# Altium schematic sheet DC_Regulator.SchDoc
size B; SheetNumber: 2; SheetTotal: 5
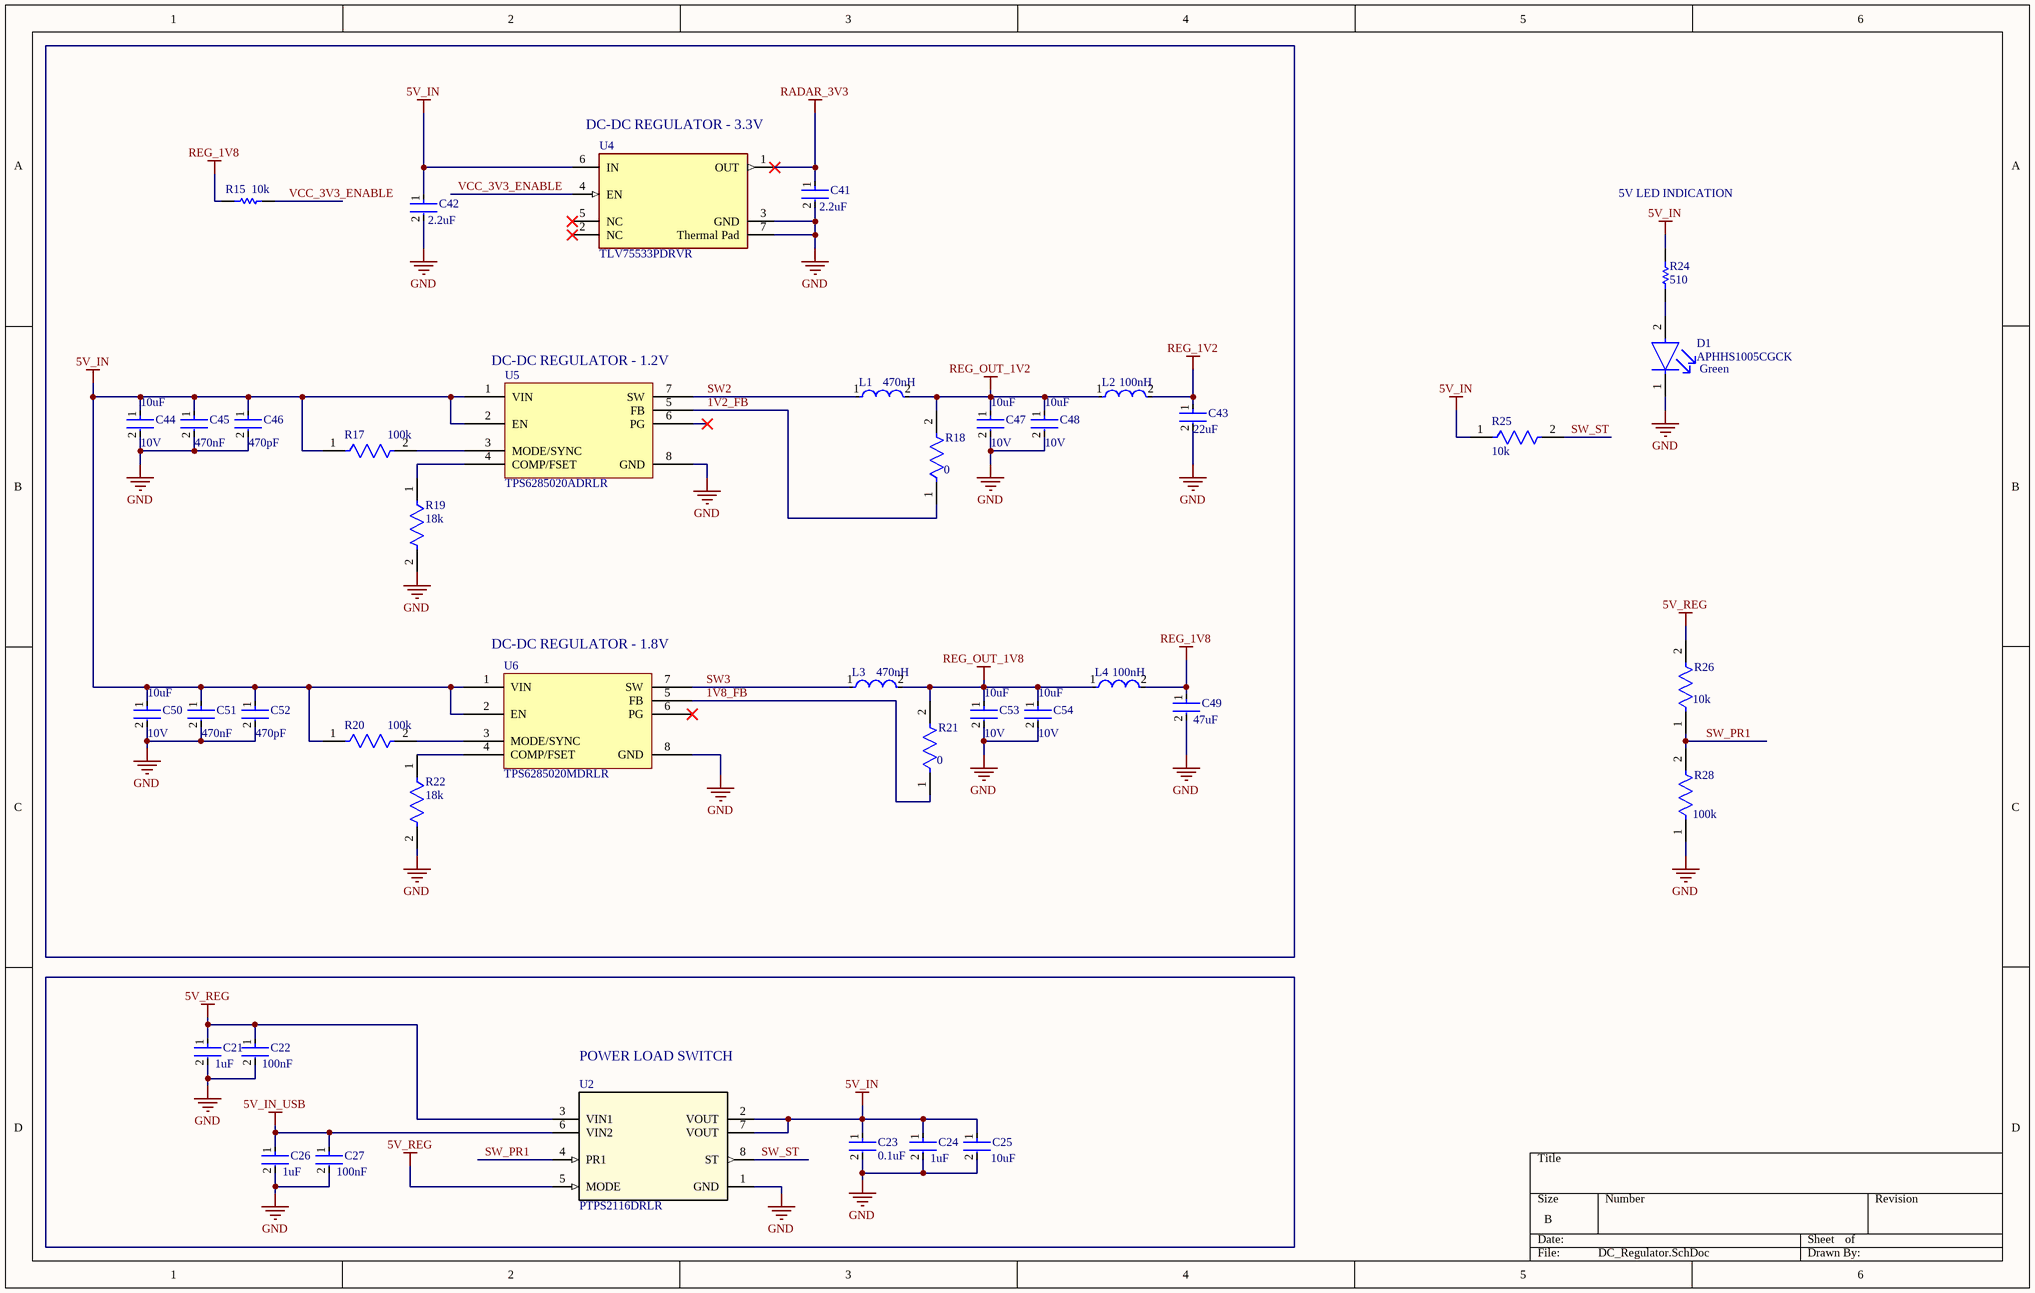
[diagram p0: DC_Regulator.SchDoc]

## Parts
C21  Capacitance: 1uF  [FP-GRT155-0_05-IPC_B]  (hidden comment: GRT155C81A105KE01D)
C22  Capacitance: 100nF  [FP-GCM155-0_05-IPC_A]  (hidden comment: GCM155R71H104KE02D)
C23  0.1uF  [FP-C0402-BB-MFG]
C24  Capacitance: 1uF  [FP-GRT155-0_05-IPC_B]  (hidden comment: GRT155C81A105KE01D)
C25  value 10uF  [FP-GRM188-0_2-IPC_B]  (hidden comment: GRM188Z71A106MA73D)
C26  Capacitance: 1uF  [FP-GRT155-0_05-IPC_B]  (hidden comment: GRT155C81A105KE01D)
C27  Capacitance: 100nF  [FP-GCM155-0_05-IPC_A]  (hidden comment: GCM155R71H104KE02D)
C41  Capacitance: 2.2uF  [FP-GRM155-0_2-MFG]  (hidden comment: GRM155C81C225KE11D)
C42  Capacitance: 2.2uF  [FP-GRM155-0_2-MFG]  (hidden comment: GRM155C81C225KE11D)
C43  Capacitance: 22uF  [FP-GRM31C-0_2-e0_3_0_8-MFG]  (hidden comment: GRM31CR70J226ME19K)
C44  Voltage Rating (DC): 10V  Capacitance: 10uF  [FP-GRM188-0_2-MFG]  (hidden comment: GRM188C81A106MA73D)
C45  Capacitance: 470nF  [FP-GRM188-0_1-e0_2_0_5-IPC_B]  (hidden comment: GRM188R71C474KA88D)
C46  Capacitance: 470pF  [FP-GRM155-0_05-IPC_A]  (hidden comment: GRM1555C1H471JA01D)
C47  Voltage Rating (DC): 10V  Capacitance: 10uF  [FP-GRM188-0_2-MFG]  (hidden comment: GRM188C81A106MA73D)
C48  Voltage Rating (DC): 10V  Capacitance: 10uF  [FP-GRM188-0_2-MFG]  (hidden comment: GRM188C81A106MA73D)
C49  Capacitance: 47uF  [FP-GRM31C-0_2-e0_3_0_8-IPC_C]  (hidden comment: GRM31CR60J476ME19L)
C50  Voltage Rating (DC): 10V  Capacitance: 10uF  [FP-GRM188-0_2-MFG]  (hidden comment: GRM188C81A106MA73D)
C51  Capacitance: 470nF  [FP-GRM188-0_1-e0_2_0_5-IPC_B]  (hidden comment: GRM188R71C474KA88D)
C52  Capacitance: 470pF  [FP-GRM155-0_05-IPC_A]  (hidden comment: GRM1555C1H471JA01D)
C53  Voltage Rating (DC): 10V  Capacitance: 10uF  [FP-GRM188-0_2-MFG]  (hidden comment: GRM188C81A106MA73D)
C54  Voltage Rating (DC): 10V  Capacitance: 10uF  [FP-GRM188-0_2-MFG]  (hidden comment: GRM188C81A106MA73D)
D1  APHHS1005CGCK  Illumination Color: Green  [FP-APHHS1005CGCK-MFG]
L1  470nH  [FP-DFE201210U-MFG]
L2  100nH  [FP-LQM2MPZ_JH-w2_4-MFG]
L3  470nH  [FP-DFE201210U-MFG]
L4  100nH  [FP-LQM2MPZ_JH-w2_4-MFG]
R15  10k  [RESC1005X40X25LL05T10]
R17  Resistance: 100k  [FP-CRCW0402-C-e3-MFG]  (hidden comment: CRCW0402100KFKEDC)
R18  Resistance: 0  [FP-RC0402-0_4-MFG]  (hidden comment: RC0402JR-070RP)
R19  Resistance: 18k  [FP-CRCW0402-e3-MFG]  (hidden comment: CRCW040218K0FKEDC)
R20  Resistance: 100k  [FP-CRCW0402-C-e3-MFG]  (hidden comment: CRCW0402100KFKEDC)
R21  Resistance: 0  [FP-RC0402-0_4-MFG]  (hidden comment: RC0402JR-070RP)
R22  Resistance: 18k  [FP-CRCW0402-e3-MFG]  (hidden comment: CRCW040218K0FKEDC)
R24  value 510  [RESC1005X40X25NL05T05]  (hidden comment: ERJ-2GEJ511X)
R25  Resistance: 10k  [FP-CRCW0402-C-e3-IPC_C]  (hidden comment: CRCW040210K0FKEDC)
R26  Resistance: 10k  [FP-CRCW0402-C-e3-IPC_C]  (hidden comment: CRCW040210K0FKEDC)
R28  Resistance: 100k  [FP-CRCW0402-e3-IPC_C]  (hidden comment: CRCW0402100KFKED)
U2  PTPS2116DRLR  [DRL0008A-MFG]
U4  TLV75533PDRVR  [FP-DRV0006A-IPC_A]
U5  TPS6285020ADRLR  [TPS6285020ADRLR]
U6  TPS6285020MDRLR  [TPS6285020MDRLR]

## Nets
5V_IN: C23.1 C24.1 C25.1 C42.1 C44.1 C45.1 C46.1 C50.1 C51.1 C52.1 R17.1 R20.1 R24.2 R25.1 U2.2(VOUT) U2.7(VOUT) U4.6(IN) U5.1(VIN) U5.2(EN) U6.1(VIN) U6.2(EN)
5V_IN_USB: C26.1 C27.1 U2.6(VIN2)
5V_REG: C21.1 C22.1 R26.2 U2.3(VIN1) U2.5(MODE)
GND: C21.2 C22.2 C23.2 C24.2 C25.2 C26.2 C27.2 C41.2 C42.2 C43.2 C44.2 C45.2 C46.2 C47.2 C48.2 C49.2 C50.2 C51.2 C52.2 C53.2 C54.2 D1.1(C) R19.2 R22.2 R28.1 U2.1(GND) U4.3(GND) U4.7(Thermal_Pad) U5.8(GND) U6.8(GND)
RADAR_3V3: C41.1 U4.1(OUT)
REG_1V2: C43.1 L2.2
REG_1V8: C49.1 L4.2 R15.1
REG_OUT_1V2: C47.1 C48.1 L1.2 L2.1 R18.2
REG_OUT_1V8: C53.1 C54.1 L3.2 L4.1 R21.2
1V2_FB: R18.1 U5.5(FB)
1V8_FB: R21.1 U6.5(FB)
SW2: L1.1 U5.7(SW)
SW3: L3.1 U6.7(SW)
SW_PR1: R26.1 R28.2 U2.4(PR1)
SW_ST: R25.2 U2.8(ST)
VCC_3V3_ENABLE: R15.2 U4.4(EN)
NetD1_2: D1.2(A) R24.1
NetR17_2: R17.2 U5.3(MODE/SYNC)
NetR19_1: R19.1 U5.4(COMP/FSET)
NetR20_2: R20.2 U6.3(MODE/SYNC)
NetR22_1: R22.1 U6.4(COMP/FSET)

Not connected (* = marked no-connect by the designer): U4 2(NC)* 5(NC)*; U5 6(PG)*; U6 6(PG)*

## Notes on the sheet
- (near U4) DC-DC REGULATOR - 3.3V
- 5V LED INDICATION
- (near U5) DC-DC REGULATOR - 1.2V
- (near U6) DC-DC REGULATOR - 1.8V
- POWER LOAD SWITCH

## Library data of the parts
C21 C24 C26 = CMP-06035-006530-1: Multi-Layer Ceramic Capacitor 1uF 10V X6S ±10% 0402 Paper T/R; Thickness: 0.022inch; Tolerance: 10%; Voltage Rating (DC): 10V; Length: 0.039inch; Width: 0.02inch; Max Operating Temperature: 105°C; Ratings: AEC-Q200; Dielectric: X6S; Min Operating Temperature: -55°C; Case/Package: 0402; Voltage Rating: 10V; Packaging: Tape and Reel; Case Code (Metric): 1005; Case Code (Imperial): 0402; Mount: Surface Mount
C22 C27 = CMP-2000-07456-3: Ceramic Capacitor for Automotive 100nF ±10% 50VDC X7R 0402 Paper T/R; Voltage Rating (DC): 50V; Package Quantity: 10000; Tolerance: 10%; Height: 0.5mm; Mount: Surface Mount; Voltage Rating: 50V; Weight: 0.000212oz; Thickness: 0.022inch; Case Code (Imperial): 0402; Length: 0.039inch; Packaging: Tape and Reel; Case Code (Metric): 1005; Min Operating Temperature: -55°C; Termination: SMD/SMT; REACH SVHC: No SVHC; Max Operating Temperature: 125°C; Lead Free: Lead Free; Dielectric: X7R; Ratings: AEC-Q200; Width: 0.5mm; Case/Package: 0402
C23 = CMP-2008-03086-2: CAP CER 0.1UF 10V X7R 0402; Manufacturer Part Number: C0402C104K8RACTU; Manufacturer: Kemet; Capacitance: 0.10 μF; Tolerance: 0.1; Temperature Coefficient: 15%; Value: 0.10 μF; Material: Ceramic; Automotive: No; Temperature Range High: +125°C; Octopart: https://octopart.com/c0402c104k8ractu-kemet-106349; ComponentLink2Description: Datasheet; ComponentLink2URL: https://content.kemet.com/datasheets/KEM_C1002_X7R_SMD.pdf; Temperature: -55°C to +125°C; RoHS: TRUE; Temperature Range Low: -55°C; Temperature Characteristic: X7R; Lead Free: Yes; Height: 0.55mm; Voltage Rating: 10 V; Category: Cap; Device Class L3: Ceramic Capacitors; Digikey Description: CAP CER 0.1UF 10V X7R 0402; Package: C0402-BB; Device Class L1: Passive Components; Ipc Land Pattern Name: CAPC10050X50; Mouser Description: Multilayer Ceramic Capacitors MLCC - SMD/SMT 10volts 0.1uF X7R 10%; Device Class L2: Capacitors
C25 = CMP-06035-036920-1: Chip Multilayer Ceramic Capacitors for General Purpose, 0603, 10uF, X7R, 15%, 20%, 10V; Case/Package: 0603
C41 C42 = CMP-06035-059778-1: Chip Multilayer Ceramic Capacitors for General Purpose, 0402, 2.2uF, X6S, 22%, 10%, 16V; Material: Ceramic; Voltage Rating: 16V; Case/Package: 0402; Tolerance: 10%; Packaging: Tape and Reel; Mount: Surface Mount; Min Operating Temperature: -55°C; Height: 0.3mm; Thickness: 0.022inch; Voltage Rating (DC): 16V; Max Operating Temperature: 105°C; Length: 0.039inch; Width: 0.02inch
C43 = CMP-06035-034814-1: Chip Multilayer Ceramic Capacitors for General Purpose, 1206, 22uF, X7R, 15%, 20%, 6.3V; Packaging: Tape and Reel; Max Operating Temperature: 125°C; Min Operating Temperature: -55°C; Length: 0.126inch; Width: 0.063inch; Voltage Rating: 6.3V; Dielectric: X7R; Package Quantity: 6000; Tolerance: 20%; Weight: 0.001411oz; Mount: Surface Mount; Thickness: 0.071inch; Case/Package: 1206; Voltage Rating (DC): 6.3V
C44 C47 C48 C50 C53 C54 = CMP-06035-002932-1: Chip Multilayer Ceramic Capacitors for General Purpose, 0603, 10uF, X6S, 22%, 20%, 10V; Case Code (Metric): 1608; Max Operating Temperature: 105°C; Thickness: 0.031inch; Width: 0.031inch; Dielectric: X6S; Lead Free: Lead Free; REACH SVHC: No SVHC; Case/Package: 0603; Length: 0.063inch; Min Operating Temperature: -55°C; Package Quantity: 4000; Voltage Rating: 10V; Tolerance: 20%; Packaging: Cut Tape; Material: Ceramic; Mount: Surface Mount; Case Code (Imperial): 0603; Height: 0.8mm
C45 C51 = CMP-2006-02860-2: Chip Multilayer Ceramic Capacitors for General Purpose, 0603, 0.47uF, X7R, 15%, 10%, 16V; Material: Ceramic; Termination: SMD/SMT; Case Code (Imperial): 0603; Height: 0.8mm; Dielectric: X7R; Length: 1.6mm; Packaging: Tape and Reel; Mount: Surface Mount; Thickness: 0.035inch; Voltage Rating (DC): 16V; Case Code (Metric): 1608; REACH SVHC: No SVHC; Depth: 0.8mm; Number of Pins: 2; Max Operating Temperature: 125°C; Min Operating Temperature: -55°C; Width: 0.8mm; Voltage: 16V; Lead Free: Lead Free; Voltage Rating: 16V; Package Quantity: 1; Case/Package: 0603; Tolerance: 10%
C46 C52 = CMP-2008-04369-2: Chip Multilayer Ceramic Capacitors for General Purpose, 0402, 470pF, C0G, 30ppm/°C, 5%, 50V; Insulation Resistance: 10GR; Depth: 0.5mm; Voltage Rating: 50V; Packaging: Tape and Reel; Material: Ceramic; Lead Free: Lead Free; Max Operating Temperature: 125°C; Length: 1mm; Min Operating Temperature: -55°C; Height: 0.5mm; Width: 0.5mm; Thickness: 0.022inch; Voltage: 50V; Termination: SMD/SMT; Dielectric Material: Ceramic; REACH SVHC: No SVHC; Voltage Rating (DC): 50V; Package Quantity: 1; Dielectric: C0G; Radiation Hardening: No; Mount: Surface Mount; Case/Package: 0402; Number of Pins: 2; Tolerance: 5%; Temperature Coefficient: 30ppm/°C; Case Code (Metric): 1005; Case Code (Imperial): 0402
C49 = CMP-2000-06344-2: Chip Multilayer Ceramic Capacitors for General Purpose, 1206, 47uF, X5R, 15%, 20%, 6.3V; Package Quantity: 2000; Mount: Surface Mount; Length: 3.2mm; Thickness: 0.071inch; Lead Free: Lead Free; Tolerance: 20%; Width: 0.063inch; Depth: 1.6mm; Case/Package: 1206; Dielectric: X5R; Radiation Hardening: No; Packaging: Tape and Reel; Voltage Rating (DC): 6.3V; Termination: SMD/SMT; Height: 1.6mm; Max Operating Temperature: 85°C; Case Code (Metric): 3216; Case Code (Imperial): 1206; Voltage: 6.3V; Voltage Rating: 6.3V; Min Operating Temperature: -55°C; Material: Ceramic; REACH SVHC: No SVHC
D1 = CMP-44529-000044-1: LED GREEN CLEAR CHIP SMD; Viewing Angle: 120°; Dominant Wavelength: 570nm; Test Current: 20mA; Luminous Intensity: 50mcd; Forward Voltage: 2.1V; Number of LEDs: 1; Lens Color: Clear; Packaging: Tape and Reel; Max Operating Temperature: 85°C; Length: 1mm; Mount: Surface Mount; Lens Style: Clear; Color: Green; Number of Pins: 2; Wavelength: 570nm; Case/Package: 0402; Width: 0.5mm; Package Quantity: 2000; Case Code (Metric): 1005; Height: 0.6mm; Lead Free: Lead Free; Case Code (Imperial): 0402; Forward Current: 20mA; Min Operating Temperature: -40°C
L1 L3 = CMP-06042-016357-2: FIXED IND .47UH 3.0A 42MOHM
L2 L4 = CMP-06042-016732-1: FIXED IND 0.1UH 4000MA INFOTMT,; RoHS Compliant: Yes
R15 = CMP-2002-07353-1: Part Number: RC0402FR-0710KL; Manufacturer: Yageo / Phycomp
R17 R20 = CMP-02407-010951-1: RES 100K OHM 1% 1/16W 0402; Temperature Coefficient: 100ppm/°C; Power Rating: 62.5mW; Lead Free: Lead Free; Length: 1mm; Tolerance: 1%; Resistor Type: Thick Film; Contact Plating: Tin; Case/Package: SMD/SMT; Min Operating Temperature: -55°C; RoHS Compliant: Yes; Termination: Wraparound; Max Operating Temperature: 155°C; Mount: Surface Mount
R18 R21 = CMP-03412-037830-1: RES SMD 0 OHM JUMPER 1/16W 0402; Max Power Dissipation: 63mW; Width: 0.02inch; Height: 0.016inch; Length: 0.039inch; Number of Terminations: 2; Max Operating Temperature: 155°C; Case Code (Metric): 1005; Resistor Type: Thick Film; RoHS Compliant: Yes; Packaging: Tape and Reel; Min Operating Temperature: -55°C; Case/Package: 0402; Features: Moisture Resistant; Case Code (Imperial): 0402
R19 R22 = CMP-02407-012458-1: RES 18K OHM 1% 1/16W 0402; Power Rating: 63mW; RoHS Compliant: Yes; Case/Package: 0402; Lead Free: Lead Free; Tolerance: 1%
R24 = CMP-2002-00551-1: Manufacturer: Panasonic; Part Number: ERJ-2GEJ511X
R25 R26 = CMP-02407-012085-1: RES 10K OHM 1% 1/16W 0402; Temperature Coefficient: 100ppm/°C; Power Rating: 62.5mW; Lead Free: Lead Free; Max Operating Temperature: 155°C; RoHS Compliant: Yes; Mount: Surface Mount; Min Operating Temperature: -55°C; Termination: Wraparound; Length: 1mm; Resistor Type: Thick Film; Contact Plating: Tin; Tolerance: 1%; Case/Package: Molded
R28 = CMP-2002-08123-3: RES Thick Film, 100kΩ, 1%, 0.063W, 100ppm/°C, 0402; Power Rating: 63mW; Voltage Rating (DC): 50V; Lead Free: Lead Free; Height: 0.35mm; Contact Plating: Tin; Min Operating Temperature: -55°C; Package Quantity: 10000; Case/Package: 0402; Temperature Coefficient: 100ppm/°C; Number of Terminations: 2; Packaging: Tape and Reel; Max Power Dissipation: 63mW; Case Code (Metric): 1005; Mount: Surface Mount; Width: 0.02inch; Termination: SMD/SMT; Length: 1mm; Number of Pins: 2; Weight: 2.3E-05oz; Radiation Hardening: No; Tolerance: 1%; Military Standard: Not; Features: Automotive AEC-Q200; Depth: 0.5mm; Composition: Thick Film; Max Operating Temperature: 155°C; Voltage Rating: 50V; Case Code (Imperial): 0402
U2 = PTPS2116DRLR: 1.6-V to 5.5-V, 40-mâ„¦, 2.5-A, low-IQ, priority power multiplexer ; 8-SOT-5X3 -40 to 125; Manufacturer_Name: Texas Instruments; TYPE: TYPE; RefDes: RefDes; Copyright: Copyright (C) 2025 Ultra Librarian. All rights reserved.; Manufacturer_Part_Number: PTPS2116DRLR
U4 = CMP-04917-000199-1: IC REG LINEAR 3.3V 500MA 6WSON; Number of Regulators: 1; Output Type: Fixed; Max Input Voltage: 5.5V; Dropout Voltage: 238mV; Quiescent Current: 31uA; Output Configuration: Positive; Power Supply Rejection Ratio (PSRR): 52dB; Max Output Voltage: 3.3V; Output Current: 500mA; Min Output Voltage: 3.3V; Packaging: Tape and Reel; Min Operating Temperature: -40°C; Mount: Surface Mount; RoHS Compliant: Yes; Max Operating Temperature: 125°C
U5 = TPS6285020ADRLR: 2.7-V to 6-V, 2-A, adjustable-frequency, step-down converter in SOT583 package 8-SOT-5X3 -40 to 150; Manufacturer: Texas Instruments; Manufacturer Lifecycle Status: ACTIVE; Topology: Buck; Supplier: DigiKey; Supplier Part Number: 296-TPS6285020ADRLRCT-ND; Manufacturer Part Number: TPS6285020ADRLR; RoHS: Compliant; Category: Voltage Regulators - Switching; Stock: 3967; Pricing: 1=1.52, 10=1.11, 25=1.0072, 100=0.8944, 250=0.8406, 500=0.80822, 1000=0.78154 (USD); Height: 0m; Length: 2.1mm; Lifecycle Status: Production; Pins: 8; Thickness: 550µm; Width: 1.2mm; ComponentLink1URL: https://sigma.octopart.com:443/184160452/technical_drawing/Texas-Instruments-TPS6285020ADRLR.pdf?src-supplier=Texas+Instruments; ComponentLink1Description: https://sigma.octopart.com:443/184160452/technical_drawing/Texas-Instruments-TPS6285020ADRLR.pdf?src-supplier=Texas+Instruments; ComponentLink2URL: https://octopart.com:443/opatz8j6/c1?t=04P0fWGL_cudllwmZINDiw2LV0UnQCBdEPC0TCiqtskBizWNZcYiud0zDodHV72PkfVAyckZwdOCP8RKkn6kOfyc1n5ayLeA0HxSBWJegEPGSGLcx5ZDwSrrVBBZMisL5iy0W6ZDyev6DYemWZv0TF3G9z2uzb8IyCt9JtlxFA4Kz3ep-HVrOA020RUMv0sDaqoO5QXkreUu2MZnPzpZ92hCZ4nlw88inlc1y5NUq3fymrAhanz4vne6D2PwE_A-BqCeNi6ywDWj7Zh3gVnmYHWucFLezg1APRGL1y_LI3b9EYi3y23IDx847xhIzfpELOnbBqVJCU5eR59dsCpX5dCCqJQSO7fhMA-LdTBewxpk-7SPURUjvrKQ9fgVnwgpJBWZzZVV-DQ&src-supplier=Texas+Instruments; ComponentLink2Description: https://octopart.com:443/opatz8j6/c1?t=04P0fWGL_cudllwmZINDiw2LV0UnQCBdEPC0TCiqtskBizWNZcYiud0zDodHV72PkfVAyckZwdOCP8RKkn6kOfyc1n5ayLeA0HxSBWJegEPGSGLcx5ZDwSrrVBBZMisL5iy0W6ZDyev6DYemWZv0TF3G9z2uzb8IyCt9JtlxFA4Kz3ep-HVrOA020RUMv0sDaqoO5QXkreUu2MZnPzpZ92hCZ4nlw88inlc1y5NUq3fymrAhanz4vne6D2PwE_A-BqCeNi6ywDWj7Zh3gVnmYHWucFLezg1APRGL1y_LI3b9EYi3y23IDx847xhIzfpELOnbBqVJCU5eR59dsCpX5dCCqJQSO7fhMA-LdTBewxpk-7SPURUjvrKQ9fgVnwgpJBWZzZVV-DQ&src-supplier=Texas+Instruments; ComponentLink3URL: https://sigma.octopart.com:443/182665545/technical_drawing/Texas-Instruments-TPS6285020ADRLR.pdf?src-supplier=Texas+Instruments; ComponentLink3Description: https://sigma.octopart.com:443/182665545/technical_drawing/Texas-Instruments-TPS6285020ADRLR.pdf?src-supplier=Texas+Instruments; ComponentLink4URL: https://sigma.octopart.com:443/158891806/technical_drawing/Texas-Instruments-TPS6285020ADRLR.pdf?src-supplier=Texas+Instruments; ComponentLink4Description: https://sigma.octopart.com:443/158891806/technical_drawing/Texas-Instruments-TPS6285020ADRLR.pdf?src-supplier=Texas+Instruments; ComponentLink5URL: http://sigma.octopart.com:80/reach_statement/Texas-Instruments-company-64.pdf?src-supplier=Compliance+Statements; ComponentLink5Description: http://sigma.octopart.com:80/reach_statement/Texas-Instruments-company-64.pdf?src-supplier=Compliance+Statements; ComponentLink6URL: http://sigma.octopart.com:80/conflict_mineral_statement/Texas-Instruments-company-63.pdf?src-supplier=Compliance+Statements; ComponentLink6Description: http://sigma.octopart.com:80/conflict_mineral_statement/Texas-Instruments-company-63.pdf?src-supplier=Compliance+Statements
U6 = TPS6285020MDRLR: 2.7-V to 6-V, 2-A, adjustable-frequency, step-down converter in SOT583 package 8-SOT-5X3 -40 to 150; Manufacturer: Texas Instruments; Manufacturer Lifecycle Status: ACTIVE; Topology: Buck; Supplier: DigiKey; Supplier Part Number: 296-TPS6285020MDRLRCT-ND; Manufacturer Part Number: TPS6285020MDRLR; RoHS: Compliant; Category: Voltage Regulators - Switching; Stock: 2434; Pricing: 1=1.52, 10=1.11, 25=1.0072, 100=0.8944, 250=0.8406, 500=0.80822, 1000=0.78154 (USD); Height: 0m; Length: 2.1mm; Lifecycle Status: Production; Pins: 8; Thickness: 550µm; Width: 1.2mm; ComponentLink1URL: https://sigma.octopart.com:443/184160452/technical_drawing/Texas-Instruments-TPS6285020MDRLR.pdf?src-supplier=Texas+Instruments; ComponentLink1Description: https://sigma.octopart.com:443/184160452/technical_drawing/Texas-Instruments-TPS6285020MDRLR.pdf?src-supplier=Texas+Instruments; ComponentLink2URL: https://octopart.com:443/opatz8j6/c1?t=j3yBvK7Knh4WlWv-GCmcuFftOO46dSNwGQl-vghnWa4P5FbmLUGqZNdsGfaa2BRR46_Y1nzoe2qF8sMvCt876JOyEgPizEtcT2yvP1vZQytL7fg4rcnOrOugqRiKWn0286UeK7FulRXUg4pTSKccoaKiJwsZgYKIRxgW7j4fAHRZJY4lsJ0ZDv8xhLvzrIp2Pcb8cqxZC7ty7vl1hVH_WtJZr1qIj67qX8542lWXUQdjGQKeDgJuvlZqR-rHtLmJKlwkQEL8PBADkijrD9-u13OcaRMmMNay04XWwwbZoMmW1KE4hF6cOnWV_RA-QnpXjrLeXbxdYo-tweympHrjh5YqTTZaQriQ9CqmxVDrh805T_blsE6klgcM7lXPiTRjw5KW9wlzXuU&src-supplier=Texas+Instruments; ComponentLink2Description: https://octopart.com:443/opatz8j6/c1?t=j3yBvK7Knh4WlWv-GCmcuFftOO46dSNwGQl-vghnWa4P5FbmLUGqZNdsGfaa2BRR46_Y1nzoe2qF8sMvCt876JOyEgPizEtcT2yvP1vZQytL7fg4rcnOrOugqRiKWn0286UeK7FulRXUg4pTSKccoaKiJwsZgYKIRxgW7j4fAHRZJY4lsJ0ZDv8xhLvzrIp2Pcb8cqxZC7ty7vl1hVH_WtJZr1qIj67qX8542lWXUQdjGQKeDgJuvlZqR-rHtLmJKlwkQEL8PBADkijrD9-u13OcaRMmMNay04XWwwbZoMmW1KE4hF6cOnWV_RA-QnpXjrLeXbxdYo-tweympHrjh5YqTTZaQriQ9CqmxVDrh805T_blsE6klgcM7lXPiTRjw5KW9wlzXuU&src-supplier=Texas+Instruments; ComponentLink3URL: https://sigma.octopart.com:443/182665545/technical_drawing/Texas-Instruments-TPS6285020MDRLR.pdf?src-supplier=Texas+Instruments; ComponentLink3Description: https://sigma.octopart.com:443/182665545/technical_drawing/Texas-Instruments-TPS6285020MDRLR.pdf?src-supplier=Texas+Instruments; ComponentLink4URL: https://sigma.octopart.com:443/158891806/technical_drawing/Texas-Instruments-TPS6285020MDRLR.pdf?src-supplier=Texas+Instruments; ComponentLink4Description: https://sigma.octopart.com:443/158891806/technical_drawing/Texas-Instruments-TPS6285020MDRLR.pdf?src-supplier=Texas+Instruments; ComponentLink5URL: https://datasheet.octopart.com:443/TPS6285020MDRLR-Texas-Instruments-datasheet-190364767.pdf?src-supplier=LCSC; ComponentLink5Description: https://datasheet.octopart.com:443/TPS6285020MDRLR-Texas-Instruments-datasheet-190364767.pdf?src-supplier=LCSC; ComponentLink6URL: http://sigma.octopart.com:80/reach_statement/Texas-Instruments-company-64.pdf?src-supplier=Compliance+Statements; ComponentLink6Description: http://sigma.octopart.com:80/reach_statement/Texas-Instruments-company-64.pdf?src-supplier=Compliance+Statements; ComponentLink7URL: http://sigma.octopart.com:80/conflict_mineral_statement/Texas-Instruments-company-63.pdf?src-supplier=Compliance+Statements; ComponentLink7Description: http://sigma.octopart.com:80/conflict_mineral_statement/Texas-Instruments-company-63.pdf?src-supplier=Compliance+Statements